# EAGLE design HarveyBehaviorPCB_v1.0 (EAGLE 8.6.3)
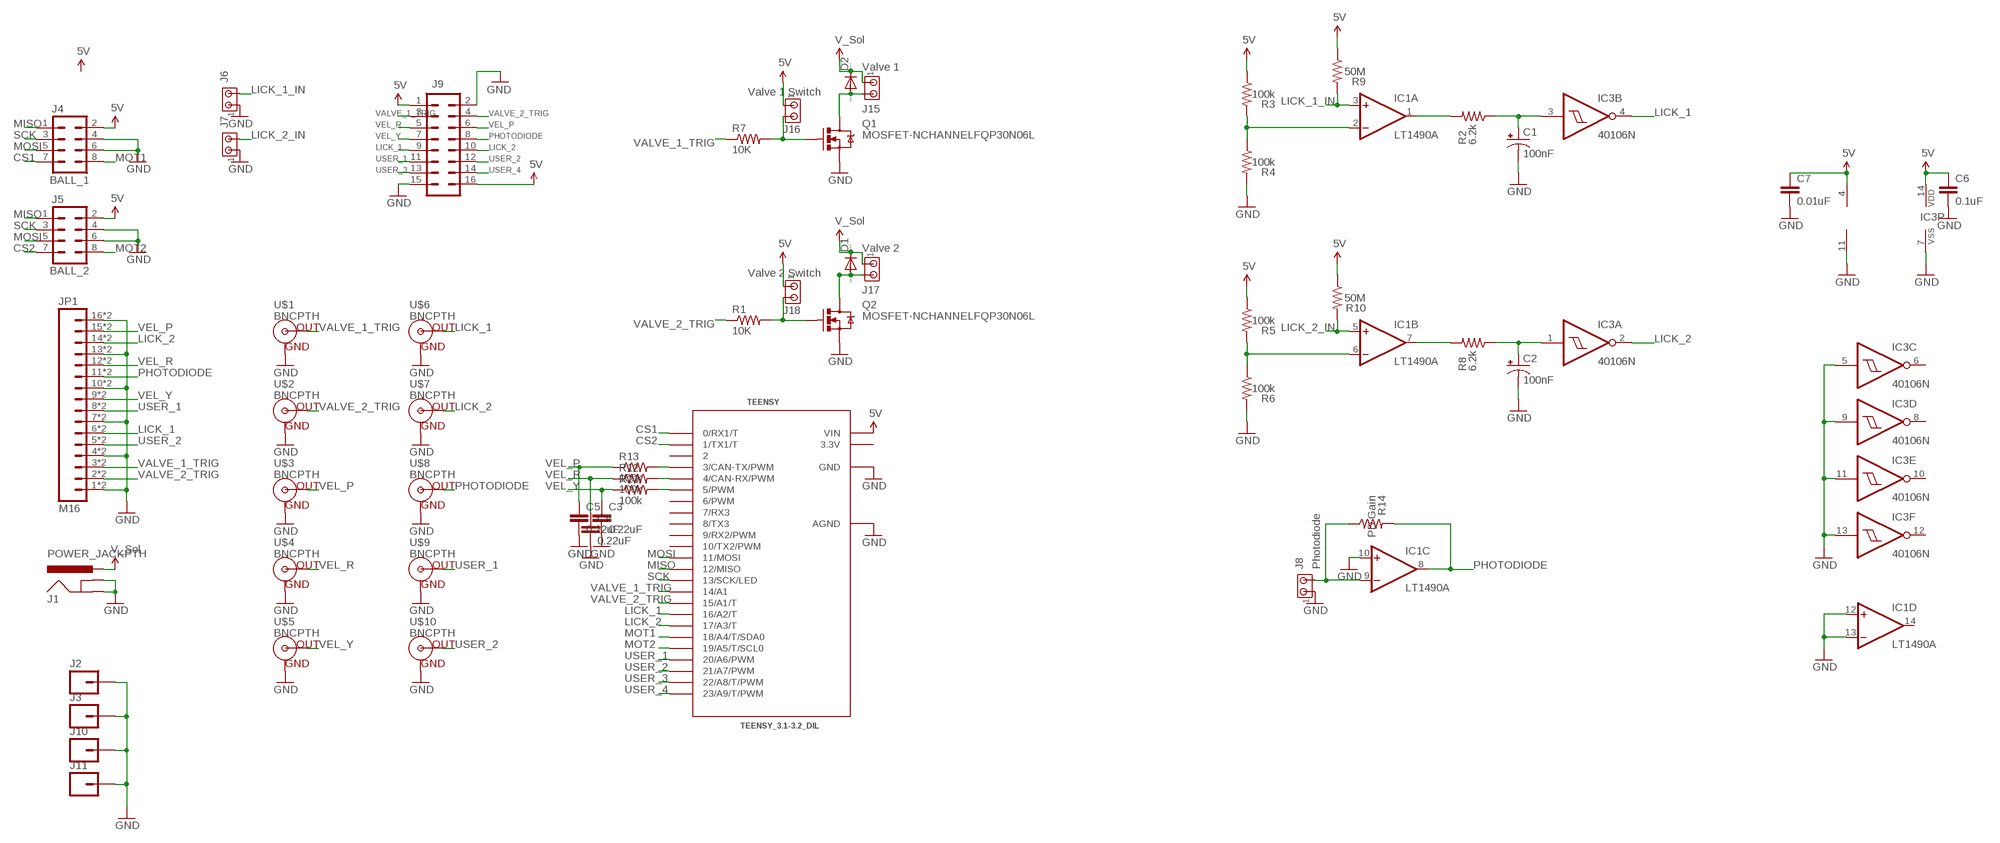
[diagram p0: schematic, sheet 1]

## Parts
C1  100nF  CAP_POLPTH2  [CPOL-RADIAL-10UF-25V]
C2  100nF  CAP_POLPTH2  [CPOL-RADIAL-10UF-25V]
C3  0.22uF  CAPPTH2  [CAP-PTH-SMALL2]
C4  0.22uF  CAPPTH2  [CAP-PTH-SMALL2]
C5  0.22uF  CAPPTH2  [CAP-PTH-SMALL2]
C6  0.1uF  0.1UF-50V-20%(PTH)KIT-EZ  [CAP-PTH-SMALL-KIT]
C7  0.01uF  0.1UF-50V-20%(PTH)KIT-EZ  [CAP-PTH-SMALL-KIT]
D1  1N4148  1N4004  [DO41-10]
D2  1N4148  1N4004  [DO41-10]
IC1  LT1490A  OPA4658P  [DIL14]
IC3  40106N  [DIL14]
J1  POWER_JACKPTH  [POWER_JACK_PTH]
J2  M01SMTSO-256-ET-0.165DIA  [SMTSO-256-ET-0.165DIA]
J3  M01SMTSO-256-ET-0.165DIA  [SMTSO-256-ET-0.165DIA]
J4  BALL_1  M04X2  [2X4]
J5  BALL_2  M04X2  [2X4]
J6  MTA02-100  [10X02MTA]
J7  MTA02-100  [10X02MTA]
J8  Photodiode  MTA02-100  [10X02MTA]
J9  M08X2  [2X8]
J10  M01SMTSO-256-ET-0.165DIA  [SMTSO-256-ET-0.165DIA]
J11  M01SMTSO-256-ET-0.165DIA  [SMTSO-256-ET-0.165DIA]
J15  Valve 1  MTA02-100  [10X02MTA]
J16  Valve 1 Switch  MTA02-100  [10X02MTA]
J17  Valve 2  MTA02-100  [10X02MTA]
J18  Valve 2 Switch  MTA02-100  [10X02MTA]
JP1  M16  [1X16_TERM_BLOCK_0.15"]
Q1  MOSFET-NCHANNELFQP30N06L  [TO220V]
Q2  MOSFET-NCHANNELFQP30N06L  [TO220V]
R1  10K  RESISTORPTH-1/2W  [AXIAL-0.5]
R2  6.2k  RESISTORPTH-1/2W  [AXIAL-0.5]
R3  100k  RESISTORPTH-1/2W  [AXIAL-0.5]
R4  100k  RESISTORPTH-1/2W  [AXIAL-0.5]
R5  100k  RESISTORPTH-1/2W  [AXIAL-0.5]
R6  100k  RESISTORPTH-1/2W  [AXIAL-0.5]
R7  10K  RESISTORPTH-1/2W  [AXIAL-0.5]
R8  6.2k  RESISTORPTH-1/2W  [AXIAL-0.5]
R9  50M  RESISTORPTH-1/2W  [AXIAL-0.5]
R10  50M  RESISTORPTH-1/2W  [AXIAL-0.5]
R11  100k  RESISTORPTH-1/2W  [AXIAL-0.5]
R12  100k  RESISTORPTH-1/2W  [AXIAL-0.5]
R13  100k  RESISTORPTH-1/2W  [AXIAL-0.5]
R14  PD Gain  RESISTORPTH-1/2W  [AXIAL-0.5]
TEENSY  TEENSY_3.1-3.2_DIL  [TEENSY_3.0-3.2&LC_DIL]
U$1  BNCPTH  [BNC]
U$2  BNCPTH  [BNC]
U$3  BNCPTH  [BNC]
U$4  BNCPTH  [BNC]
U$5  BNCPTH  [BNC]
U$6  BNCPTH  [BNC]
U$7  BNCPTH  [BNC]
U$8  BNCPTH  [BNC]
U$9  BNCPTH  [BNC]
U$10  BNCPTH  [BNC]

## Nets
5V: C6.1 C7.1 IC1.4(P:V+) IC3.14(P:VDD) J4.2 J5.2 J9.1 J9.16 J16.1 J18.1 R3.P$1 R5.P$1 R9.P$1 R10.P$1 TEENSY.VIN
CS1: J4.7 TEENSY.0(0/RX1/T)
CS2: J5.7 TEENSY.1(1/TX1/T)
GND: C1.2(-) C2.2(-) C3.2 C4.2 C5.2 C6.2 C7.2 IC1.10(C:+IN) IC1.11(P:V-) IC1.12(D:+IN) IC1.13(D:-IN) IC3.5(C:I) IC3.7(P:VSS) IC3.9(D:I) IC3.11(E:I) IC3.13(F:I) J1.GND J1.GNDBREAK J2.P$1 J3.P$1 J4.4 J4.6 J5.4 J5.6 J6.1 J7.1 J8.1 J9.2 J9.15 J10.P$1 J11.P$1 JP1.1 JP1.4 JP1.7 JP1.10 JP1.13 JP1.16 JP1.17 JP1.20 JP1.23 JP1.26 JP1.29 JP1.32 Q1.3(S) Q2.3(S) R4.P$2 R6.P$2 TEENSY.AGND TEENSY.GND U$1.GND U$2.GND U$3.GND U$4.GND U$5.GND U$6.GND U$7.GND U$8.GND U$9.GND U$10.GND
LICK_1: IC3.4(B:O) J9.9 JP1.6 JP1.22 TEENSY.16/A2(16/A2/T) U$6.S(OUT)
LICK_1_IN: IC1.3(A:+IN) J6.2 R9.P$2
LICK_2: IC3.2(A:O) J9.10 JP1.14 JP1.30 TEENSY.17/A3(17/A3/T) U$7.S(OUT)
LICK_2_IN: IC1.5(B:+IN) J7.2 R10.P$2
MISO: J4.1 J5.1 TEENSY.12(12/MISO)
MOSI: J4.5 J5.5 TEENSY.11(11/MOSI)
MOT1: J4.8 TEENSY.18/A4(18/A4/T/SDA0)
MOT2: J5.8 TEENSY.19/A5(19/A5/T/SCL0)
N$1: C1.1(+) IC3.3(B:I) R2.P$1
N$2: IC1.1(A:OUT) R2.P$2
N$3: IC1.2(A:-IN) R3.P$2 R4.P$1
N$4: D2.A J15.2 Q1.2(D)
N$5: J16.2 Q1.1(G) R7.P$2
N$6: D1.A J17.2 Q2.2(D)
N$7: J18.2 Q2.1(G) R1.P$2
N$8: IC1.6(B:-IN) R5.P$2 R6.P$1
N$9: C2.1(+) IC3.1(A:I) R8.P$1
N$10: IC1.7(B:OUT) R8.P$2
PHOTODIODE: IC1.8(C:OUT) J9.8 JP1.11 JP1.27 R14.P$2 U$8.S(OUT)
PHOTODIODE_IN: IC1.9(C:-IN) J8.2
SCK: J4.3 J5.3 TEENSY.13(13/SCK/LED)
USER_1: J9.11 JP1.8 JP1.24 TEENSY.20/A6(20/A6/PWM) U$9.S(OUT)
USER_2: J9.12 JP1.5 JP1.21 TEENSY.21/A7(21/A7/PWM) U$10.S(OUT)
USER_3: J9.13 TEENSY.22/A8(22/A8/T/PWM)
USER_4: J9.14 TEENSY.23/A9(23/A9/T/PWM)
VALVE_1_TRIG: J9.3 JP1.3 JP1.19 R7.P$1 TEENSY.14/A0(14/A1) U$1.S(OUT)
VALVE_2_TRIG: J9.4 JP1.2 JP1.18 R1.P$1 TEENSY.15/A1(15/A1/T) U$2.S(OUT)
VEL_P: C5.1 J9.6 JP1.15 JP1.31 R13.P$1 U$3.S(OUT)
VEL_P_PWM: R13.P$2 TEENSY.3(3/CAN-TX/PWM)
VEL_R: C4.1 J9.5 JP1.12 JP1.28 R12.P$1 U$4.S(OUT)
VEL_R_PWM: R12.P$2 TEENSY.4(4/CAN-RX/PWM)
VEL_Y: C3.1 J9.7 JP1.9 JP1.25 R11.P$1 U$5.S(OUT)
VEL_Y_PWM: R11.P$2 TEENSY.5(5/PWM)
VSOL: D1.C D2.C J1.PWR J15.1 J17.1 ; supply symbol labelled V_Sol
Unconnected: IC1.14(D:OUT) IC3.6(C:O) IC3.8(D:O) IC3.10(E:O) IC3.12(F:O) R14.P$1 TEENSY.2 TEENSY.6(6/PWM) TEENSY.7(7/RX3) TEENSY.8(8/TX3) TEENSY.9(9/RX2/PWM) TEENSY.10(10/TX2/PWM)

## Power pins joined to a net without a drawn wire
3.3V: TEENSY.3.3V

## Library data of the parts
C1 C2 = SparkFun-Capacitors:CAP_POL: Capacitor Polarized These are standard SMD and PTH capacitors. Normally 10uF, 47uF, and 100uF in electrolytic and tantalum varieties. Always verify the external diameter of the through hole cap, it varies with capacity, voltage, and manufacturer. The EIA devices should be standard.
C3-C5 = SparkFun-Capacitors:CAP: Capacitor Standard 0603 ceramic capacitor, and 0.1" leaded capacitor.
C6 C7 = SparkFun-Capacitors:0.1UF-50V-20%(PTH): CAP-08370; PROD_ID: CAP-08370
D1 D2 = diode:1N4004: DIODE general purpose rectifier, 1 A
IC1 = linear:OPA4658: Quad Wideband, Low Power Current Feedback OP AMP
IC3 = 40xx:40106: Hex SCHMITT TRIGGER
J1 = SparkFun-Connectors:POWER_JACK: Power Jack This is the standard 5.5mm barrel jack for power. The PTH is the most common, proven, reliable, footprint. The Slot footprint only works if the mill layer is transmitted to the PCB fab house so be warned. Mating wall wart : TOL-00298 (and others); PROD_ID: CONN-08197
J2 J3 J10 J11 = SparkFun-Connectors:M01: Header 1 Standard 1-pin 0.1" header. Use with straight break away headers (SKU : PRT-00116), right angle break away headers (PRT-00553), swiss pins (PRT-00743), machine pins (PRT-00117), and female headers (PRT-00115). SMTSO-256-ET is a "flush mount" nut for a 4-40 screw. The older package used to be too tight, and did not allow it to sit properly thru the drill hit. The latest (0.165DIA) fits nice and snug.
J4 J5 = SparkFun-Connectors:M04X2: .1" header, two rows of four.
J6-J8 J15-J18 = con-amp:MTA02-100: AMP connector
J9 = SparkFun-Connectors:M08X2: .1" headers, two rows of 8 each
JP1 = ofer-eagle-lib:M16: 1x16 .1" header
Q1 Q2 = SparkFun-DiscreteSemi:MOSFET-NCHANNEL: Common NMOSFET Parts MFG P/N Store ID Prod ID FDD8780 TRANS-09984 SI7820DN TRANS-11055 FDS6630A IC-08089 2N7002PW TRANS-11151 FQP30N06L COM-10213 TRANS-10060 BSS123LT1G TRANS-08345 BSS138 TRANS-00830 BS170 2N7000; PROD_ID: TRANS-10060
R1-R14 = SparkFun-Resistors:RESISTOR: Resistor Basic schematic elements and footprints for 0603, 1206, and PTH resistors.
TEENSY = Teensy_3_and_LC_Series_Boards_v1.4:TEENSY_3.1-3.2_DIL: Teensy 3.1 or 3.2 in a DIL Layout.
U$1-U$10 = SparkFun-Connectors:BNC: BNC Connector, Mouser Part# 5227161

## Board
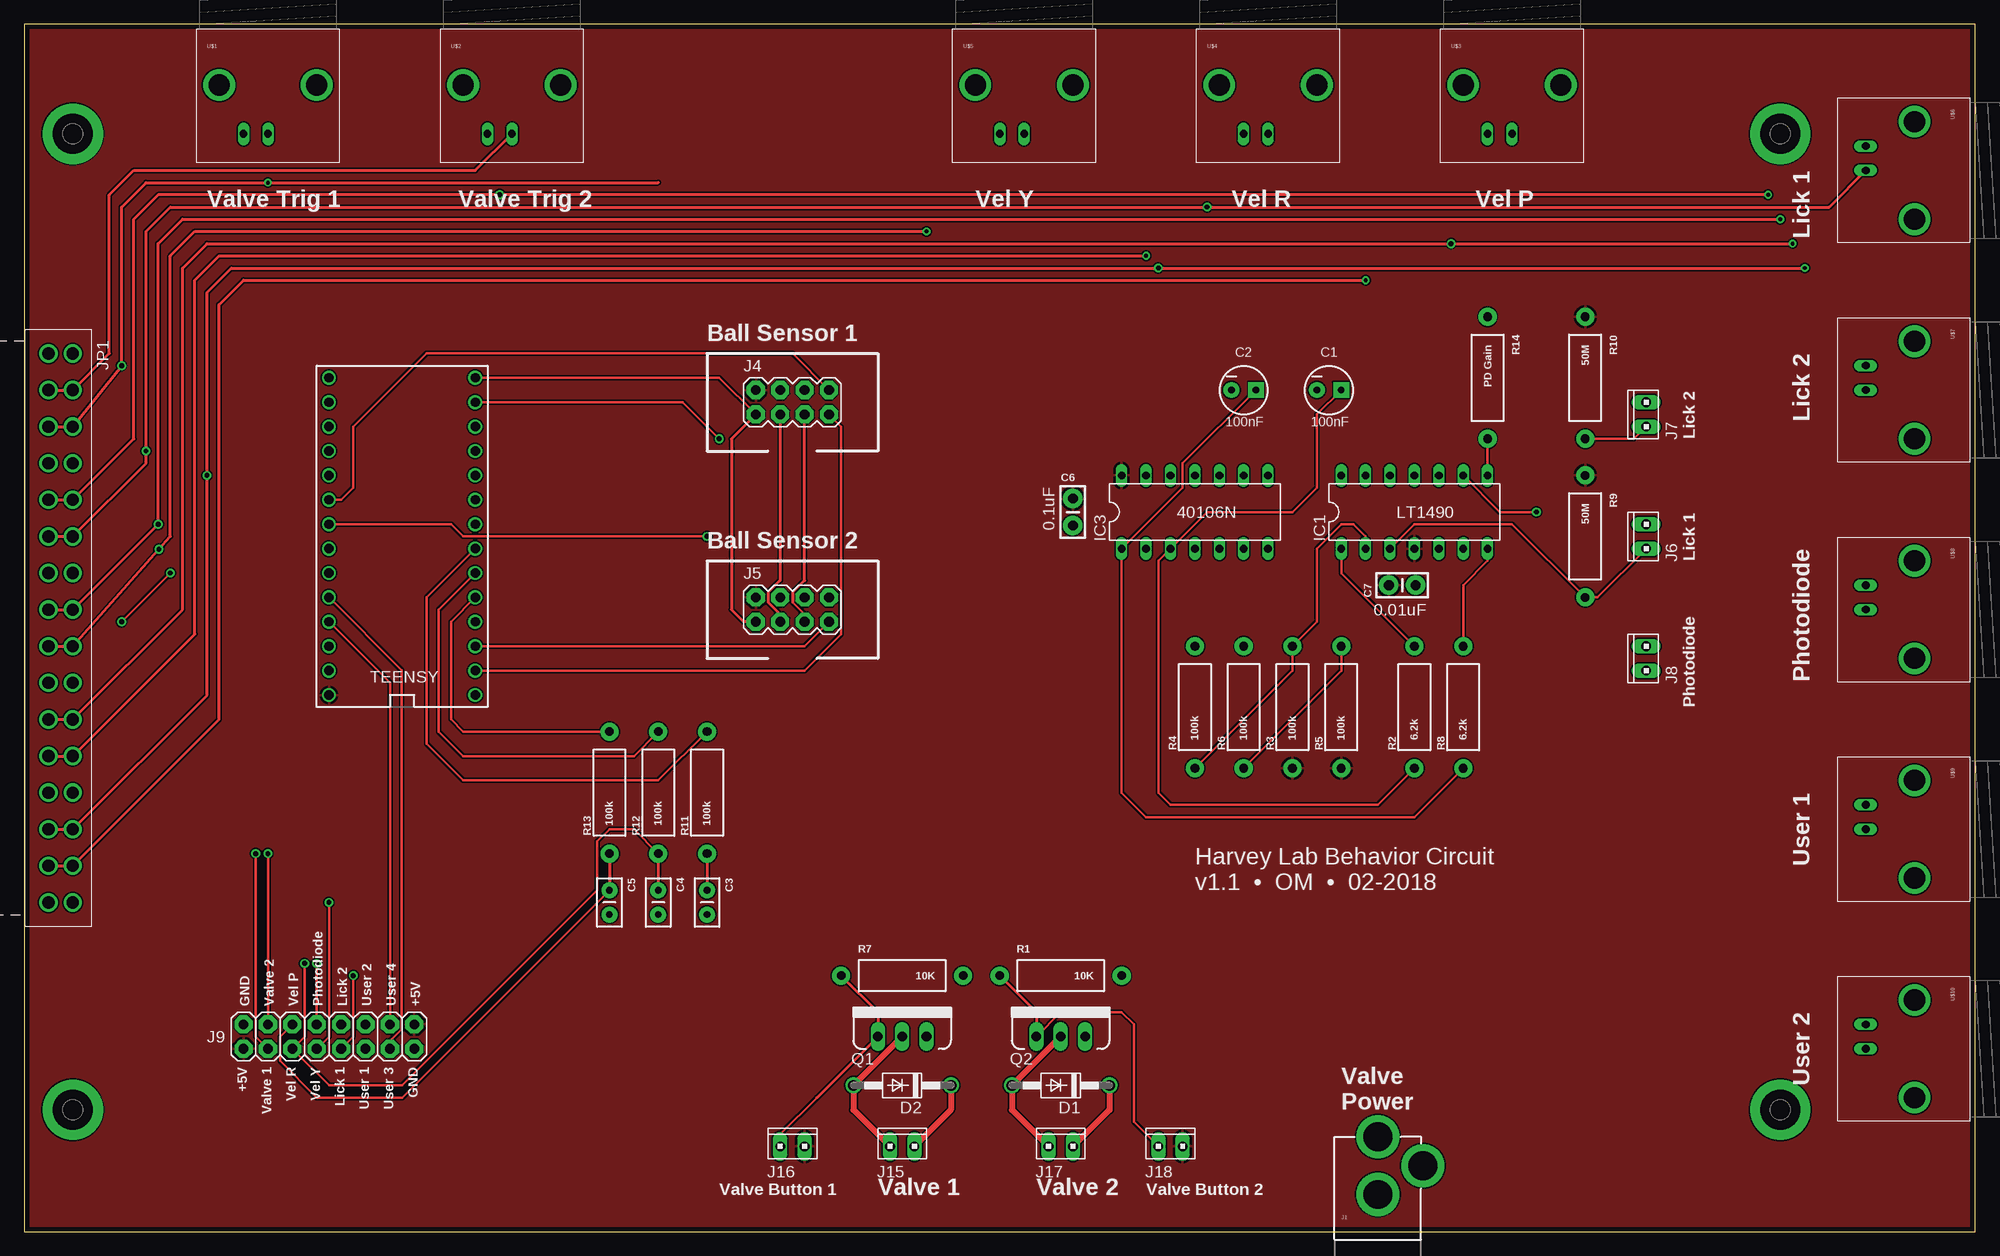
[diagram p1: board, top side]
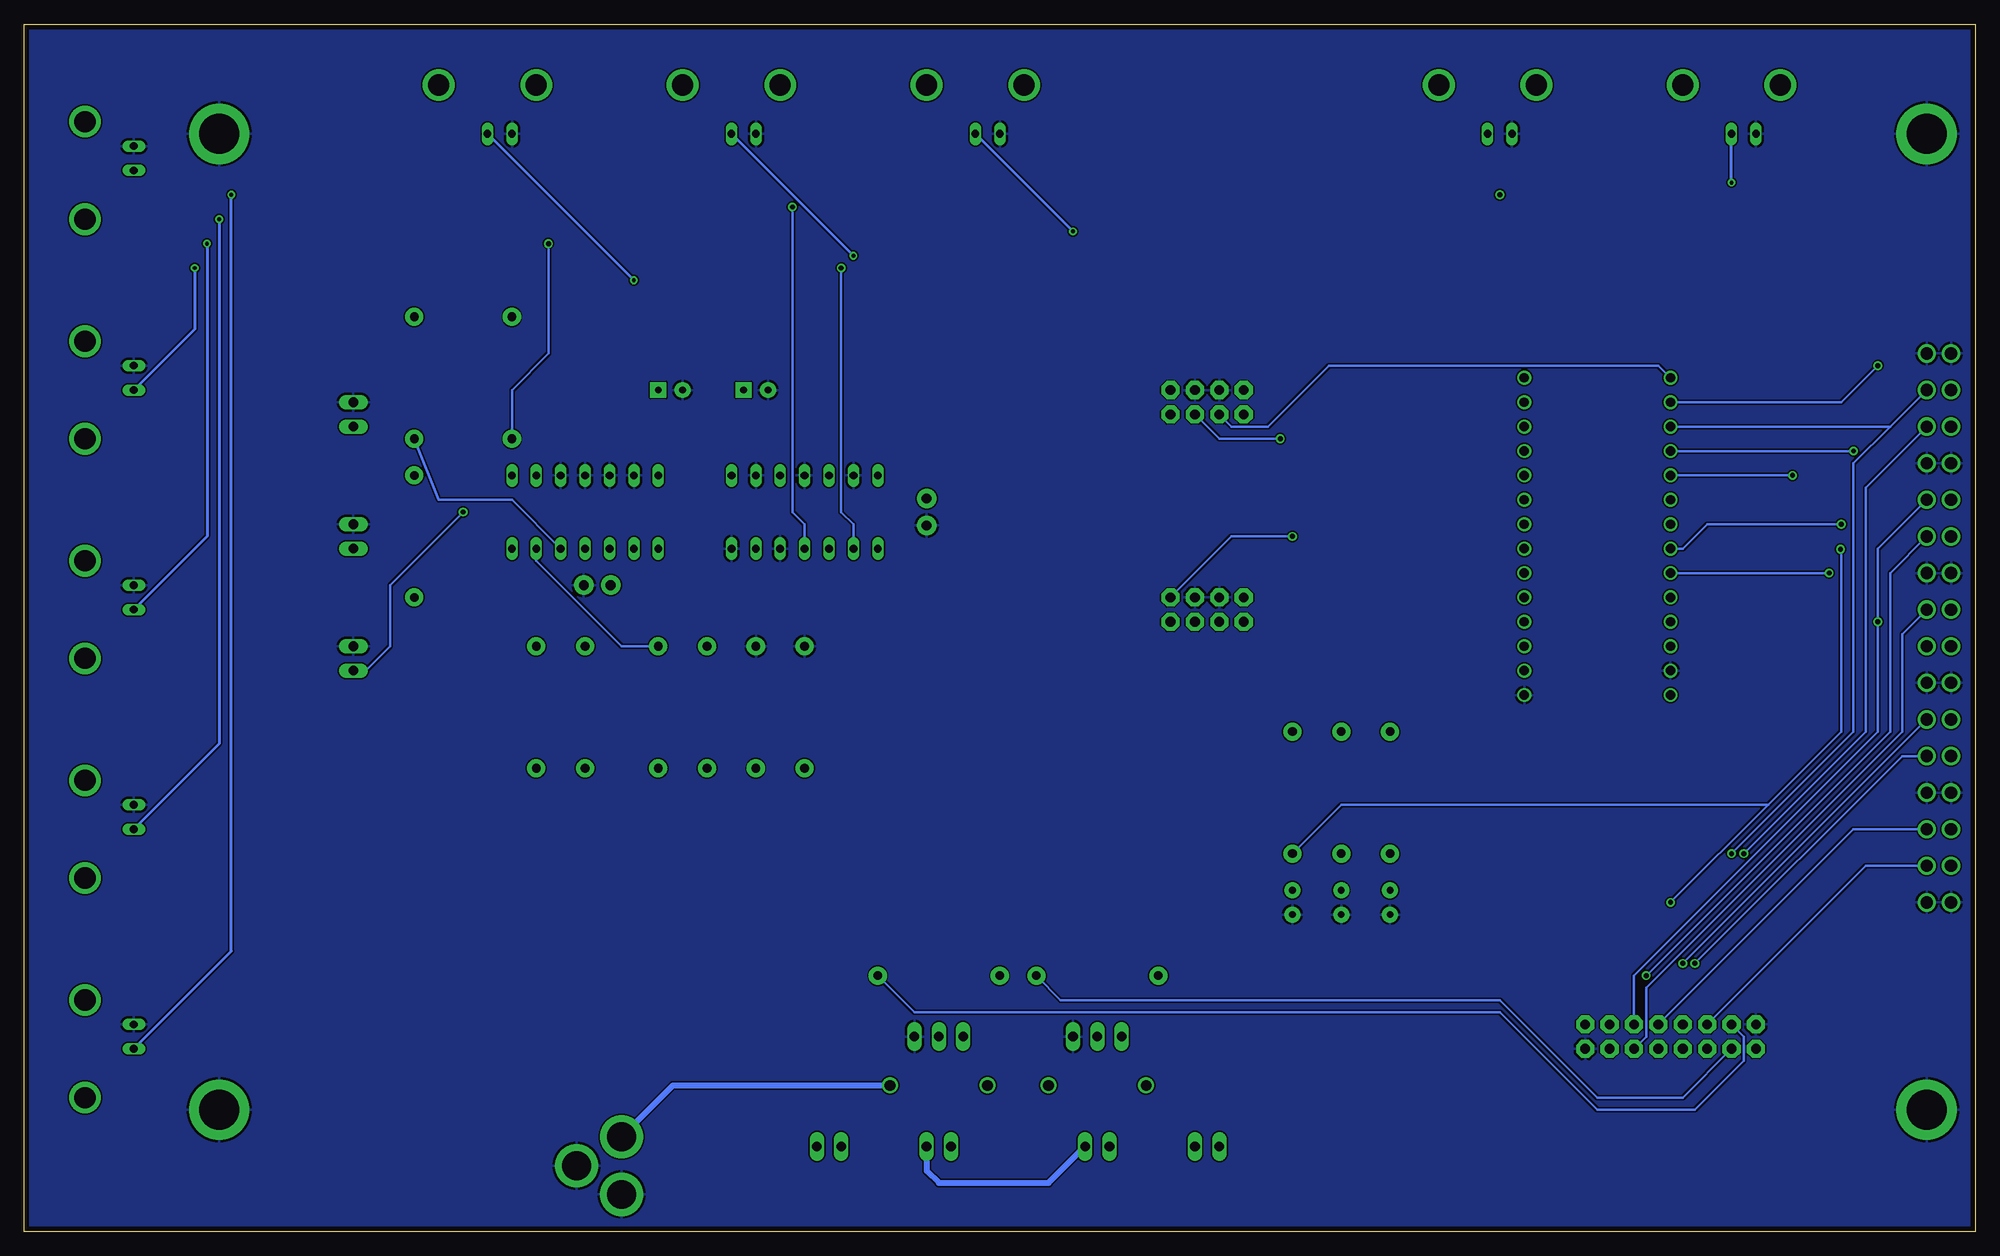
[diagram p2: board, bottom side, seen from below]

Size 203.2 x 125.73 mm. Coordinates in mm from the lower left corner, seen from the top.
Outline: 0,0 203.2,0 203.2,125.73 0,125.73 0,0
Copper layers (1*16): Top 0.0178mm / dielectric 59mil / Bottom 0.0178mm
Design rules "SSC-EAGLE-2Lyr_v1.0.0.3": minimum track width 6mil, minimum drill 14mil, track to track 6mil, track to pad 6mil, pad to pad 6mil, via to via 6mil, smd to smd 6mil, copper to edge 20mil, drill to drill 16mil, minimum pad ring 8mil, minimum via ring 8mil, stop-mask expansion 3mil, vias tented up to drill 0mil, thermal gap 10mil

### Footprints (pad centres in the part's own frame; a part is rotated, then mirrored left to right if it is on the bottom)
CPOL-RADIAL-10UF-25V = drill 0.7 pad 1.651 square: 1 1.27,0 | drill 0.7 pad 1.651: 2 -1.27,0
CAP-PTH-SMALL2 = drill 0.7 pad 1.651: 1 0,0; 2 2.54,0
CAP-PTH-SMALL-KIT = drill 1.016 pad 2.032: 1 -1.397,0; 2 1.397,0
DO41-10 = drill 1.118: A 5.08,0; C -5.08,0
DIL14 = drill 0.813 long: 1 -7.62,-3.81; 2 -5.08,-3.81; 3 -2.54,-3.81; 4 0,-3.81; 5 2.54,-3.81; 6 5.08,-3.81; 7 7.62,-3.81; 8 7.62,3.81; 9 5.08,3.81; 10 2.54,3.81; 11 0,3.81; 12 -2.54,3.81; 13 -5.08,3.81; 14 -7.62,3.81
POWER_JACK_PTH = drill 2.997 pad 4.318: GND 0,7.7; GNDBREAK 4.7,10.7; PWR 0,13.7
SMTSO-256-ET-0.165DIA = drill 4.191 pad 6.198: P$1 0,0
2X4 = drill 1.016 pad 1.88 octagon: 1 -3.81,-1.27; 2 -3.81,1.27; 3 -1.27,-1.27; 4 -1.27,1.27; 5 1.27,-1.27; 6 1.27,1.27; 7 3.81,-1.27; 8 3.81,1.27
10X02MTA = drill 1.016 long: 1 1.27,0; 2 -1.27,0
2X8 = drill 1.016 pad 1.88 octagon: 1 0,0; 2 0,2.54; 3 2.54,0; 4 2.54,2.54; 5 5.08,0; 6 5.08,2.54; 7 7.62,0; 8 7.62,2.54; 9 10.16,0; 10 10.16,2.54; 11 12.7,0; 12 12.7,2.54; 13 15.24,0; 14 15.24,2.54; 15 17.78,0; 16 17.78,2.54
1X16_TERM_BLOCK_0.15" = drill 1.27: 1 0,0; 17 0,-2.54 | drill 1.27 pad 1.88: 2 3.81,0; 3 7.62,0; 4 11.43,0; 5 15.24,0; 6 19.05,0; 7 22.86,0; 8 26.67,0; 9 30.48,0; 10 34.29,0; 11 38.1,0; 12 41.91,0; 13 45.72,0; 14 49.53,0; 15 53.34,0; 16 57.15,0; 18 3.81,-2.54; 19 7.62,-2.54; 20 11.43,-2.54; 21 15.24,-2.54; 22 19.05,-2.54; 23 22.86,-2.54; 24 26.67,-2.54; 25 30.48,-2.54; 26 34.29,-2.54; 27 38.1,-2.54; 28 41.91,-2.54; 29 45.72,-2.54; 30 49.53,-2.54; 31 53.34,-2.54; 32 57.15,-2.54
TO220V = drill 1.016 long: 1 -2.54,0; 2 0,0; 3 2.54,0
AXIAL-0.5 = drill 0.9 pad 1.88: P$1 -6.35,0; P$2 6.35,0
TEENSY_3.0-3.2&LC_DIL = drill 0.965: 0 -7.62,13.97; 1 -7.62,11.43; 2 -7.62,8.89; 3 -7.62,6.35; 3.3V 7.62,11.43; 4 -7.62,3.81; 5 -7.62,1.27; 6 -7.62,-1.27; 7 -7.62,-3.81; 8 -7.62,-6.35; 9 -7.62,-8.89; 10 -7.62,-11.43; 11 -7.62,-13.97; 12 -7.62,-16.51; 13 7.62,-16.51; 14/A0 7.62,-13.97; 15/A1 7.62,-11.43; 16/A2 7.62,-8.89; 17/A3 7.62,-6.35; 18/A4 7.62,-3.81; 19/A5 7.62,-1.27; 20/A6 7.62,1.27; 21/A7 7.62,3.81; 22/A8 7.62,6.35; 23/A9 7.62,8.89; AGND 7.62,13.97; GND -7.62,16.51; VIN 7.62,16.51
BNC = drill 2.2: 3 -5.08,5.08; 4 5.08,5.08 | drill 0.8 long: GND -2.54,0; S 0,0

### Placement (x,y rotation side)
C1  135.89,87.63 0 top
C2  127,87.63 0 top
C3  71.12,35.56 270 top
C4  66.04,35.56 270 top
C5  60.96,35.56 270 top
C6  109.22,74.93 270 top
C7  143.51,67.31 0 top
D1  107.95,15.24 180 top
D2  91.44,15.24 180 top
IC1  144.78,74.93 0 top
IC3  121.92,74.93 0 top
J1  140.97,-3.81 0 top
J2  5.08,12.7 0 top
J3  5.08,114.3 0 top
J4  80.01,86.36 0 top
J5  80.01,64.77 0 top
J6  168.91,72.39 90 top
J7  168.91,85.09 90 top
J8  168.91,59.69 90 top
J9  22.86,19.05 0 top
J10  182.88,114.3 0 top
J11  182.88,12.7 0 top
J15  91.44,8.89 0 top
J16  80.01,8.89 0 top
J17  107.95,8.89 0 top
J18  119.38,8.89 0 top
JP1  5.08,91.44 270 top
Q1  91.44,20.32 0 top
Q2  107.95,20.32 0 top
R1  107.95,26.67 180 top
R2  144.78,54.61 90 top
R3  132.08,54.61 90 top
R4  121.92,54.61 90 top
R5  137.16,54.61 90 top
R6  127,54.61 90 top
R7  91.44,26.67 180 top
R8  149.86,54.61 90 top
R9  162.56,72.39 270 top
R10  162.56,88.9 270 top
R11  71.12,45.72 90 top
R12  66.04,45.72 90 top
R13  60.96,45.72 90 top
R14  152.4,88.9 270 top
TEENSY  39.37,72.39 180 top
U$1  25.4,114.3 0 top
U$2  50.8,114.3 0 top
U$3  154.94,114.3 0 top
U$4  129.54,114.3 0 top
U$5  104.14,114.3 0 top
U$6  191.77,110.49 270 top
U$7  191.77,87.63 270 top
U$8  191.77,64.77 270 top
U$9  191.77,41.91 270 top
U$10  191.77,19.05 270 top

### Tracks (layer width: path | path; a pad name or v marks a point on that pad's centre or on a via)
5V
  pour Top: -3.81,128.27 207.01,128.27 207.01,-2.54 -1.27,-2.54
CS1
  Top 0.254: TEENSY.0 81.28,58.42 85.09,62.23 85.09,83.82 J4.7
CS2
  Top 0.254: TEENSY.1 81.28,60.96 J5.7
GND
  pour Bottom: -3.81,128.27 207.01,128.27 207.01,-2.54 -1.27,-2.54
LICK_1  (via drill 0.51)
  Top 0.254: v34.29,26.67 34.29,20.32 J9.9
  Top 0.305: JP1.22 JP1.6 12.7,80.01 v12.7,81.28 12.7,104.14 15.24,106.68 v123.19,106.68 187.96,106.68 U$6.S
  Bottom 0.254: JP1.6 8.89,68.58 8.89,52.07 v34.29,26.67 | TEENSY.16/A2 v12.7,81.28 | IC3.4 121.92,73.66 123.19,74.93 v123.19,106.68
LICK_1_IN
  Top 0.254: IC1.3 144.78,73.66 154.94,73.66 R9.P$2 163.83,66.04 J6.2
LICK_2  (via drill 0.4, 0.51)
  Top 0.305: JP1.30 JP1.14 19.05,55.88 v19.05,78.74 19.05,97.79 21.59,100.33 v118.11,100.33 v185.42,100.33
  Bottom 0.254: JP1.14 12.7,41.91 J9.10 | TEENSY.17/A3 v19.05,78.74 | IC3.2 116.84,73.66 118.11,74.93 v118.11,100.33
  Bottom 0.305: v185.42,100.33 185.42,93.98 U$7.S
LICK_2_IN
  Top 0.254: R10.P$2 167.64,82.55 J7.2
  Bottom 0.254: IC1.5 152.4,76.2 160.02,76.2 R10.P$2
MISO
  Top 0.254: TEENSY.12 72.39,88.9 J4.1
  Top 0.305: J5.1 74.93,63.5 73.66,64.77 73.66,82.55 J4.1
MOSI  (via drill 0.51)
  Top 0.254: 80.03,65.52 81.28,64.28 J5.5 | TEENSY.11 68.58,86.36 v72.39,82.55
  Top 0.305: 80.03,65.52 80.03,66.56 81.28,67.8 J4.5
  Bottom 0.254: v72.39,82.55 78.74,82.55 J4.5
MOT1
  Top 0.254: J4.8 80.01,91.44 41.91,91.44 34.29,83.82 34.29,77.47 33.02,76.2 TEENSY.18/A4
MOT2  (via drill 0.51)
  Top 0.254: TEENSY.19/A5 44.45,73.66 45.72,72.39 v71.12,72.39
  Bottom 0.254: v71.12,72.39 77.47,72.39 J5.8
N$1
  Top 0.254: R2.P$1 140.97,44.45 119.38,44.45 118.11,45.72 118.11,69.85 IC3.3 123.19,74.93 132.08,74.93 134.62,77.47 134.62,85.09 C1.1
N$2
  Top 0.254: R2.P$2 137.16,68.58 IC1.1
N$3
  Top 0.254: R4.P$1 132.08,58.42 R3.P$2 134.62,63.5 134.62,71.12 137.16,73.66 138.43,73.66 139.7,72.39 IC1.2
N$4
  Top 0.61: J15.2 86.36,12.7 D2.A Q1.2
N$5
  Top 0.254: J16.2 78.74,10.16 82.55,13.97
  Top 0.305: R7.P$2 88.9,22.86 Q1.1 82.55,13.97
N$6
  Top 0.61: J17.2 102.87,12.7 D1.A Q2.2
N$7
  Top 0.254: J18.2 115.57,11.43 115.57,21.59 114.3,22.86 107.95,22.86 Q2.1
  Top 0.305: R1.P$2 105.41,22.86 Q2.1
N$8
  Top 0.254: R6.P$1 137.16,58.42 R5.P$2
  Bottom 0.254: R5.P$2 140.97,60.96 149.86,69.85 IC1.6
N$9
  Top 0.254: R8.P$1 144.78,43.18 116.84,43.18 114.3,45.72 IC3.1 120.65,77.47 120.65,80.01 C2.1
N$10
  Top 0.254: R8.P$2 149.86,67.31 152.4,69.85 IC1.7
PHOTODIODE  (via drill 0.4, 0.51)
  Top 0.254: IC1.8 R14.P$2 | v30.48,27.94 J9.8
  Top 0.305: JP1.27 JP1.11 16.51,64.77 16.51,100.33 19.05,102.87 v148.59,102.87 v184.15,102.87
  Bottom 0.254: JP1.11 v30.48,27.94 | R14.P$2 152.4,87.63 148.59,91.44 v148.59,102.87
  Bottom 0.305: v184.15,102.87 184.15,72.39 U$8.S
PHOTODIODE_IN  (via drill 0.51)
  Top 0.254: IC1.9 153.67,74.93 v157.48,74.93
  Bottom 0.254: v157.48,74.93 165.1,67.31 165.1,60.96 167.64,58.42 J8.2
SCK
  Top 0.305: 77.96,85.09 J4.3 78.74,67.8 77.5,66.56 77.5,65.52 78.74,64.28 J5.3
  Bottom 0.254: TEENSY.13 33.02,90.17 67.31,90.17 73.66,83.82 77.47,83.82 J4.3
USER_1  (via drill 0.4, 0.51)
  Top 0.305: JP1.24 JP1.8 v13.97,73.66 13.97,102.87 16.51,105.41 v182.88,105.41
  Bottom 0.254: JP1.8 7.62,62.23 7.62,52.07 34.29,25.4 34.29,20.32 J9.11 | TEENSY.20/A6 30.48,71.12 27.94,73.66 v13.97,73.66
  Bottom 0.305: v182.88,105.41 182.88,50.8 U$9.S
USER_2  (via drill 0.4, 0.51)
  Top 0.254: v15.24,68.58 v10.16,63.5
  Top 0.305: JP1.21 JP1.5 11.43,82.55 11.43,105.41 13.97,107.95 v49.53,107.95 v181.61,107.95
  Bottom 0.254: JP1.5 10.16,71.12 v10.16,63.5 10.16,52.07 35.56,26.67 J9.12 | TEENSY.21/A7 v15.24,68.58
  Bottom 0.305: U$10.S 181.61,29.21 v181.61,107.95
USER_3
  Top 0.254: J9.13 38.1,19.87 39.32,21.09 39.32,58.47 TEENSY.22/A8
USER_4
  Top 0.254: TEENSY.23/A9 38.1,57.15 J9.14
VALVE_1_TRIG  (via drill 0.4, 0.51)
  Top 0.254: v24.13,39.37 24.13,20.32 J9.3
  Top 0.305: JP1.19 JP1.3 v10.16,90.17 10.16,106.68 12.7,109.22 v25.4,109.22 66.04,109.22
  Bottom 0.254: JP1.3 11.43,77.47 11.43,52.07 v24.13,39.37 | TEENSY.14/A0 13.97,86.36 v10.16,90.17 | R7.P$1 95.25,24.13 49.53,24.13 39.37,13.97 30.48,13.97 J9.3
  Bottom 0.305: v25.4,109.22 U$1.S
VALVE_2_TRIG  (via drill 0.51)
  Top 0.254: J9.4 v25.4,39.37
  Top 0.305: JP1.18 JP1.2 8.89,91.44 8.89,107.95 11.43,110.49 46.99,110.49 U$2.S
  Bottom 0.254: v25.4,39.37 12.7,52.07 12.7,80.01 8.89,83.82 | 8.89,83.82 JP1.2 | TEENSY.15/A1 8.89,83.82 | J9.4 24.13,20.32 24.13,17.78 29.21,12.7 39.37,12.7 49.53,22.86 110.49,22.86 R1.P$1
VEL_P  (via drill 0.4)
  Top 0.254: C5.1 39.37,13.97 30.48,13.97 26.67,17.78 26.67,20.32 J9.6
  Top 0.305: JP1.31 JP1.15 20.32,53.34 20.32,96.52 22.86,99.06 v139.7,99.06 | R13.P$1 C5.1
  Bottom 0.254: JP1.15 11.43,38.1 J9.6
  Bottom 0.305: v139.7,99.06 U$3.S
VEL_P_PWM
  Top 0.254: TEENSY.3 44.45,63.5 44.45,53.34 45.72,52.07 R13.P$2
VEL_R  (via drill 0.4, 0.51)
  Top 0.254: v29.21,27.94 29.21,20.32 J9.5 31.75,15.24 39.37,15.24 59.69,35.56 59.69,40.64 60.96,41.91 63.5,41.91 R12.P$1
  Top 0.305: JP1.28 JP1.12 17.78,62.23 17.78,99.06 20.32,101.6 v116.84,101.6 | R12.P$1 C4.1
  Bottom 0.254: JP1.12 7.62,49.53 v29.21,27.94
  Bottom 0.305: v116.84,101.6 U$4.S
VEL_R_PWM
  Top 0.254: TEENSY.4 43.18,64.77 43.18,52.07 45.72,49.53 63.5,49.53 R12.P$2
VEL_Y  (via drill 0.4, 0.51)
  Top 0.254: J9.7 31.75,20.32 v31.75,34.29
  Top 0.305: JP1.25 JP1.9 v14.05,71.05 15.24,72.39 15.24,101.6 17.78,104.14 v93.98,104.14 | R11.P$1 C3.1
  Bottom 0.254: v31.75,34.29 21.59,44.45 | 21.59,44.45 13.97,52.07 13.97,71.12 13.98,71.12 v14.05,71.05 | R11.P$1 66.04,44.45 21.59,44.45
  Bottom 0.305: v93.98,104.14 U$5.S
VEL_Y_PWM
  Top 0.254: TEENSY.5 41.91,66.04 41.91,50.8 45.72,46.99 66.04,46.99 R11.P$2
VSOL
  Top 0.61: D2.C 96.52,12.7 J15.1 | D1.C 113.03,12.7 J17.1
  Bottom 0.61: J17.1 109.22,6.35 107.95,5.08 96.52,5.08 J15.1 | J1.PWR 135.62,15.24 D1.C

### Text on the board
tNames: Lick 1 | Valve Trig 1 | Valve Trig 2 | Vel Y | Vel R | Vel P | Ball Sensor 1 | Lick 2 | 100nF | 100nF | Lick 2 | C6 | 40106N | LT1490 | 0.1uF | Ball Sensor 2 | Photodiode | Lick 1 | C7 | 0.01uF | Photodiode | User 1 | Harvey Lab Behavior Circuit / v1.1 • OM • 02-2018 | GND | Valve 2 | Vel P | Photodiode | Lick 2 | User 2 | User 4 | +5V | User 2 | +5V | Valve 1 | Vel R | Vel Y | Lick 1 | User 1 | User 3 | GND | Valve / Power | Valve Button 1 | Valve 1 | Valve 2 | Valve Button 2